# EAGLE design USBFilter (EAGLE 9.5.2)
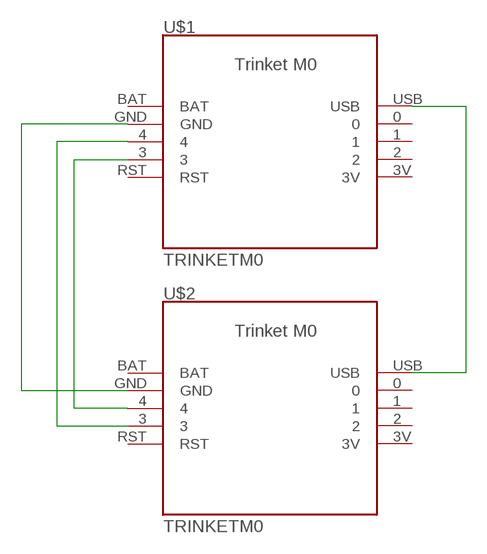
[diagram p0: schematic, sheet 1]

## Parts
U$1  TRINKETM0  [TRINKET]
U$2  TRINKETM0  [TRINKET]

## Nets
GND: U$1.GND U$2.GND
N$1: U$1.4 U$2.3
N$2: U$1.3 U$2.4
USB: U$1.USB U$2.USB
Unconnected: U$1.0 U$1.1 U$1.2 U$1.3V U$1.BAT U$1.RST U$2.0 U$2.1 U$2.2 U$2.3V U$2.BAT U$2.RST

## Library data of the parts
U$1 U$2 = ATMakers:TRINKETM0: Trinket M0

## Board
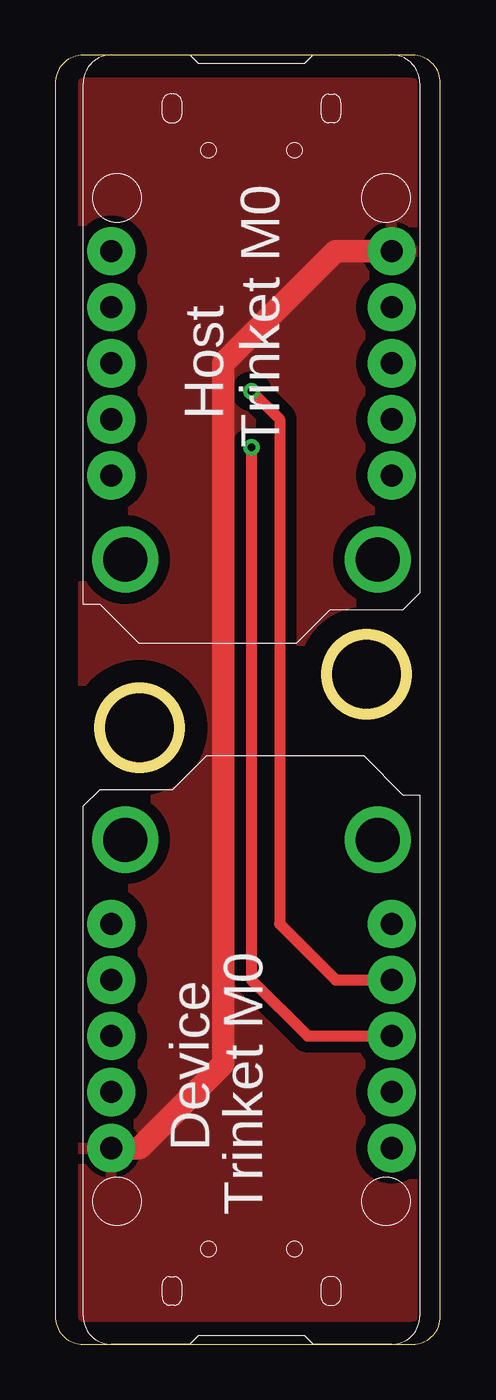
[diagram p1: board, top side]
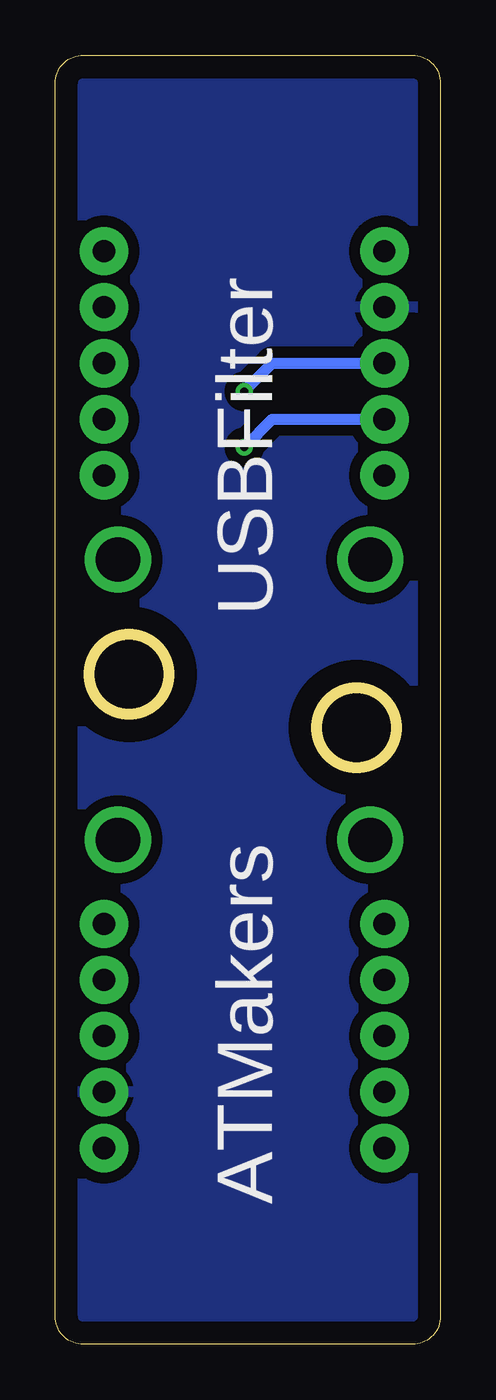
[diagram p2: board, bottom side, seen from below]

Size 17.45 x 58.41 mm. Coordinates in mm from the lower left corner, seen from the top.
Outline: 16.18,58.41 1.27,58.41 arc90 0,57.14 0,1.27 arc90 1.27,0 16.18,0 arc90 17.45,1.27 17.45,57.14 arc90 16.18,58.41
Outline: circle at 3.81,27.94 radius 1.8
Outline: circle at 14.1,30.35 radius 1.8
Copper layers (1*16): Top 0.035mm / dielectric 1.5mm / Bottom 0.035mm
Design rules "default *": minimum track width 6mil, minimum drill 0.35mm, track to track 6mil, track to pad 6mil, pad to pad 6mil, via to via 6mil, smd to smd 6mil, copper to edge 40mil, drill to drill 6mil, minimum pad ring 10mil, minimum via ring 8mil, stop-mask expansion 4mil, vias tented up to drill 20mil, thermal gap 10mil

### Footprints (pad centres in the part's own frame; a part is rotated, then mirrored left to right if it is on the bottom)
TRINKET = drill 1 pad 2.184: 0 6.35,1.27; 1 6.35,-1.27; 2 6.35,-3.81; 3 -6.35,-3.81; 3V 6.35,-6.35; 4 -6.35,-1.27; BAT -6.35,3.81; GND -6.35,1.27; RST -6.35,-6.35; USB 6.35,3.81 | drill 2 pad 3: TR11 -5.715,-10.16; TR12 5.715,-10.16

### Placement (x,y rotation side)
U$1  8.89,45.72 0 top
U$2  8.89,12.7 180 top

### Tracks (layer width: path | path; a pad name or v marks a point on that pad's centre or on a via)
GND
  pour Bottom (isolate 0.508): 0,57.15 17.78,57.15 17.78,1.27 arc-90 16.51,0 -1.27,0 -1.27,55.88
N$1  (via drill 0.35)
  Top 0.508: v8.89,43.18 10.16,41.91 10.16,19.05 12.7,16.51 U$2.3
  Bottom 0.508: v8.89,43.18 7.62,44.45 U$1.4
N$2  (via drill 0.35)
  Top 0.508: U$2.4 11.43,13.97 8.89,16.51 v8.89,40.64
  Bottom 0.508: v8.89,40.64 7.62,41.91 U$1.3
USB
  Top 1.016: U$1.USB 12.7,49.53 7.62,44.45 7.62,12.7 3.81,8.89 U$2.USB
  pour Top (isolate 0.508): 0,58.42 17.78,58.42 17.78,-1.27 -1.27,-1.27 -1.27,57.15

### Text on the board
tPlace: Host | Device
bPlace: USBFilter | ATMakers